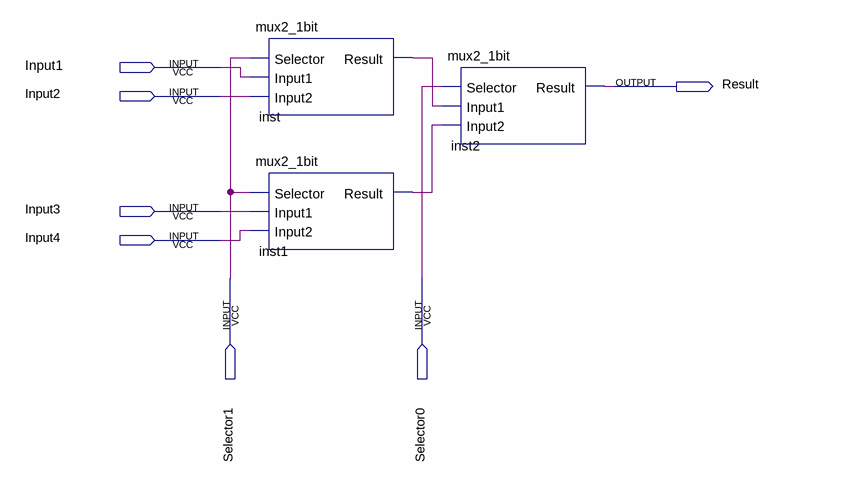
[diagram p0: schematic sheet]
// Quartus schematic mux4_1bit.bdf as structural Verilog: 3 symbols, 7 pins
module mux4_1bit (
  input  Input1,
  input  Input2,
  input  Input3,
  input  Input4,
  input  Selector1,
  input  Selector0,
  output Result
);

  wire inst1_result, inst_result;

  mux2_1bit inst (.Selector(Selector1), .Input1(Input1), .Input2(Input2), .Result(inst_result));
  mux2_1bit inst1 (.Selector(Selector1), .Input1(Input3), .Input2(Input4), .Result(inst1_result));
  mux2_1bit inst2 (.Selector(Selector0), .Input1(inst_result), .Input2(inst1_result), .Result(Result));
endmodule
